# Altium schematic sheet Sheet1.SchDoc
size A
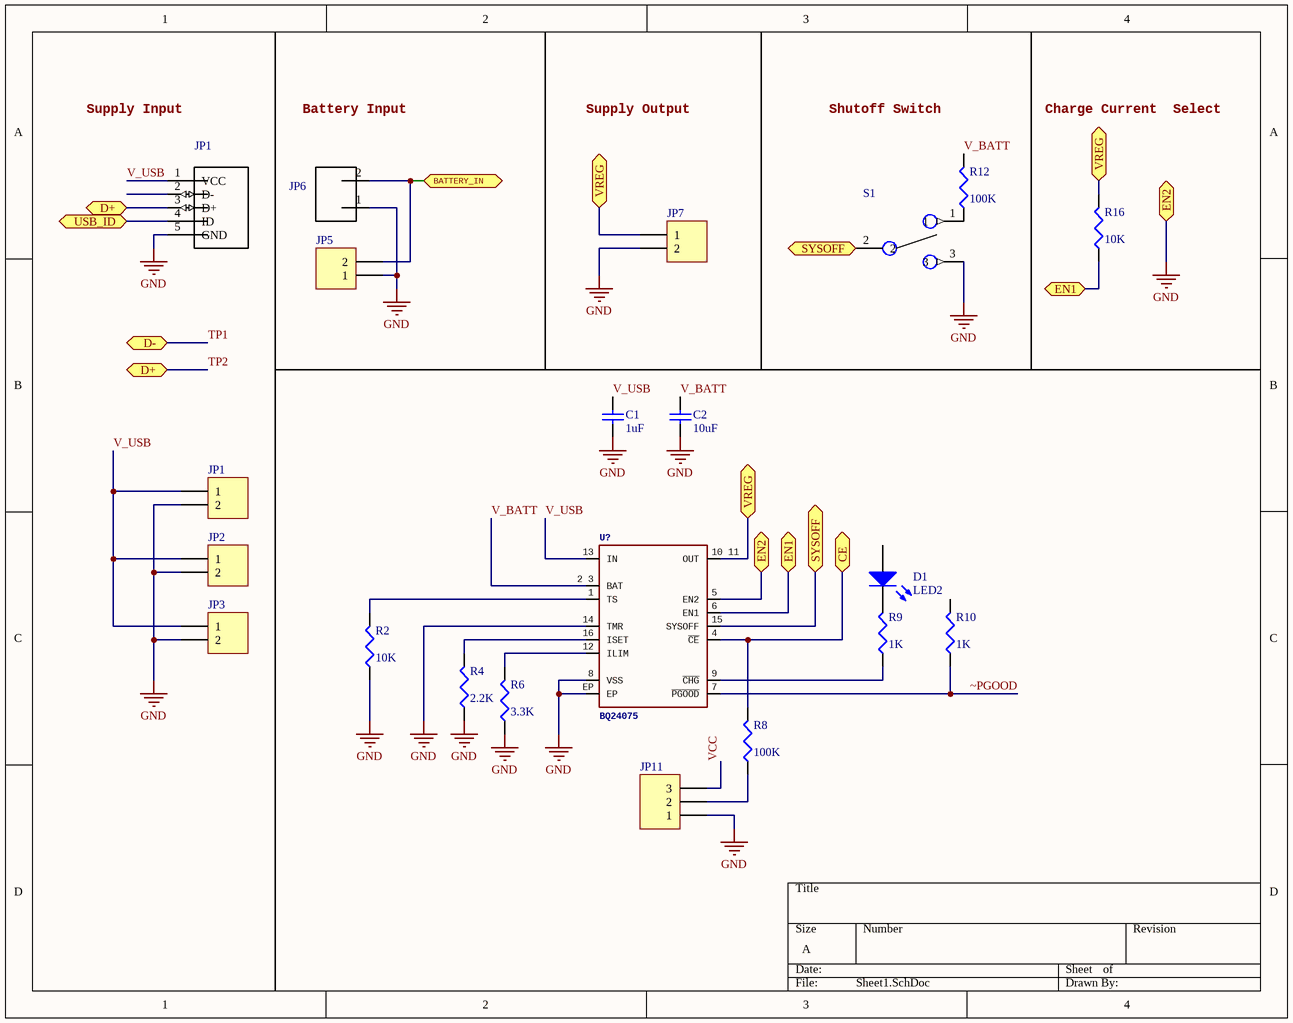
[diagram p0: Sheet1.SchDoc]

## Parts
(Parts that share a designator on the sheet are numbered #1, #2 ... from top to bottom, then left to right.)
C1  value 1uF  [1608[0603]]  (hidden comment: Cap Semi)
C2  value 10uF  [1608[0603]]  (hidden comment: Cap Semi)
D1  LED2  [3.2X1.6X1.1]
JP1#1  0475901001  [MOLEX_0475901001]  (value not drawn)
JP1#2  Header 2  [HDR1X2]  (value not drawn)
JP2  Header 2  [HDR1X2]  (value not drawn)
JP3  Header 2  [HDR1X2]  (value not drawn)
JP5  Header 2  [HDR1X2]  (value not drawn)
JP6  S2B-PH-SM4-TB(LF)(SN)  [S2B-PH-SM4-TB(LF)(SN)]  (value not drawn)
JP7  Header 2  [HDR1X2]  (value not drawn)
JP11  Header 3  [HDR1X3]  (value not drawn)
R2  value 10K  [1608[0603]]  (hidden comment: Res3)
R4  value 2.2K  [1608[0603]]  (hidden comment: Res3)
R6  value 3.3K  [1608[0603]]  (hidden comment: Res3)
R8  value 100K  [1608[0603]]  (hidden comment: Res3)
R9  value 1K  [1608[0603]]  (hidden comment: Res3)
R10  value 1K  [1608[0603]]  (hidden comment: Res3)
R12  value 100K  [1608[0603]]  (hidden comment: Res3)
R16  value 10K  [1608[0603]]  (hidden comment: Res3)
S1  AYZ0102AGRLC  [SW_AYZ0102AGRLC]  (value not drawn)
U?  BQ24075  [QFN50P300X300X100-17N]

## Ports
BATTERY_IN, CE, D+, D-, EN1, EN2, SYSOFF, USB_ID, VREG

## Nets
GND: C1.1 C2.1 JP1#1.5(GND) JP1#2.2 JP2.2 JP3.2 JP5.1 JP6.1 JP7.2 JP11.1 R2.1 R4.1 R6.1 S1.3 U?.5(EN2) U?.8(VSS) U?.14(TMR) U?.EP ; port EN2
BATTERY_IN: JP5.2 JP6.2 ; port BATTERY_IN
CE: R8.2 U?.4(~{CE}) ; port CE
EN1: R16.1 U?.6(EN1) ; port EN1
SYSOFF: S1.2 U?.15(SYSOFF) ; port SYSOFF
TP1: port D-
TP2: JP1#1.3(D+) ; port D+
USB_ID: JP1#1.4(ID) ; port USB_ID
V_BATT: C2.2 R12.2 U?.2_3(BAT)
V_USB: C1.2 JP1#1.1(VCC) JP1#2.1 JP2.1 JP3.1 U?.13(IN)
VCC: JP11.3
VREG: JP7.1 R16.2 U?.10_11(OUT) ; port VREG
~PGOOD: R10.1 U?.7(~{PGOOD})
NetJP11_2: JP11.2 R8.1
NetR2_2: R2.2 U?.1(TS)
NetR4_2: R4.2 U?.16(ISET)
NetR6_2: R6.2 U?.12(ILIM)
NetR9_1: R9.1 U?.9(~{CHG})
NetR12_1: R12.1 S1.1

Not connected (* = marked no-connect by the designer): D1 1(A) 2(K); JP1#1 2(D-); R9 2; R10 2

## Notes on the sheet
- Supply Input
- Battery Input
- Supply Output
- Shutoff Switch
- Charge Current
  Select

## Library data of the parts
C1 = Cap Semi: CAP CER 0.1UF 25V X7R 0603; Manufacturer: Murata Electronics North America; Manufacturer Part Number: GCM188R71E104KA57D; Digi-Key Part Number: 490-6051-1-ND; ComponentLink1URL: https://www.digikey.com/product-detail/en/murata-electronics-north-america/GCM188R71E104KA57D/490-6051-1-ND/3845251; ComponentLink1Description: Digi-Key Link
C2 = Cap Semi: CAP CER 10UF 25V X5R 1206; Manufacturer: Murata Electronics North America; Manufacturer Part Number: GJ831CR61E106KE83L; Digi-Key Part Number: 490-14441-1-ND; ComponentLink1URL: https://www.digikey.com/product-detail/en/murata-electronics-north-america/GJ831CR61E106KE83L/490-14441-1-ND/6606902; ComponentLink1Description: Digi-Key Link
D1 = LED2: Typical RED, GREEN, YELLOW, AMBER GaAs LED; Published: 8-Jun-2000; LatestRevisionDate: 17-Jul-2002; LatestRevisionNote: Re-released for DXP Platform.; PackageVersion: Feb-2002; PackageReference: 3.2X1.6X1.1; Publisher: Altium Limited; PackageDescription: SM LED; 2 Flat Leads
JP1#1 = 0475901001: Conn Micro USB Type AB RCP 5 POS 0.65mm Solder RA SMD 5 Terminal 1 Port Embossed T/R; Manufacturer: Molex, LLC; Digi-Key Part Number: WM14336CT-ND; Manufacturer Part Number: 0475901001; ComponentLink1URL: https://www.digikey.com/products/en/connectors-interconnects/usb-dvi-hdmi-connectors/312?k=0475901001&k=&pkeyword=0475901001&pv7=2&sf=0&quantity=&ColumnSort=0&page=1&pageSize=25; ComponentLink1Description: Digi-Key Link
JP1#2 JP2 JP3 JP5 JP7 = Header 2: Header, 2-Pin
JP6 = S2B-PH-SM4-TB(LF)(SN): CONN HEADER PH SIDE 2POS 2MM SMD; Manufacturer: JST Sales America Inc.; Digi-Key Part Number: 455-1749-1-ND; Manufacturer Part Number: S2B-PH-SM4-TB(LF)(SN); ComponentLink1URL: https://www.digikey.com/products/en/connectors-interconnects/rectangular-connectors-headers-male-pins/314?k=S2B-PH-SM4-TB%28LF%29%28SN%29&k=&pkeyword=S2B-PH-SM4-TB%28LF%29%28SN%29&pv7=2&sf=0&quantity=&ColumnSort=0&page=1&pageSize=25; ComponentLink1Description: Digi-Key URL
JP11 = Header 3: Header, 3-Pin; LatestRevisionDate: 17-Jul-2002; LatestRevisionNote: Re-released for DXP Platform.; Publisher: Altium Limited
R2 R16 = Res3: RES SMD 10K OHM 1% 1/8W 0603; Manufacturer: Vishay Beyschlag; Manufacturer Part Number: MCT06030C1002FP500; Digi-Key Part Number: MCT0603-10.0K-CFCT-ND; ComponentLink1URL: https://www.digikey.com/products/en?keywords=MCT0603-10.0K-CFCT-ND; ComponentLink1Description: Digi-Key URL
R4 = Res3: RES SMD 2.2K OHM 1% 1/10W 0603; Manufacturer: Panasonic Electronic Components; Manufacturer Part Number: ERJ-3EKF2201V; Digi-Key Part Number: P2.20KHCT-ND; ComponentLink1URL: https://www.digikey.com/product-detail/en/panasonic-electronic-components/ERJ-3EKF2201V/P2.20KHCT-ND/1746742; ComponentLink1Description: Digi-Key URL
R6 R8 R12 = Res3: RES SMD 3.3K OHM 5% 1/10W 0603; Manufacturer: Panasonic Electronic Components; Manufacturer Part Number: ERJ-3GEYJ332V; Digi-Key Part Number: P3.3KGCT-ND; ComponentLink1URL: https://www.digikey.com/product-detail/en/panasonic-electronic-components/ERJ-3GEYJ332V/P3.3KGCT-ND/135146; ComponentLink1Description: Digi-Key URL
R9 R10 = Res3: RES SMD 1K OHM 1% 1/8W 0603; Manufacturer: Vishay Beyschlag; Published: 8-Jun-2000; LatestRevisionDate: 29-May-2009; LatestRevisionNote: IPC-7351 Footprint Added.; PackageReference: J1-0603; Publisher: Altium Limited; PackageDescription: Chip Resistor; Digi-Key Part Number: Digi-Key Part Number; Component1LinkURL: http://www.vishay.com/docs/28705/mcx0x0xpro.pdf; ComponentLink1Description: Digi-Key URL
S1 = AYZ0102AGRLC: SWITCH SLIDE SPDT 100MA 12V; Manufacturer: C&K; Digi-Key Part Number: 401-2012-1-ND; Manufacturer Part Number: AYZ0102AGRLC; ComponentLink1URL: https://www.digikey.com/products/en/switches/slide-switches/213?k=AYZ0102AGRLC&k=&pkeyword=AYZ0102AGRLC&pv7=2&sf=0&quantity=&ColumnSort=0&page=1&pageSize=25; ComponentLink1Description: Digi-Key Link
U? = BQ24075: IC LI-ION CHARGE MGMT 16-QFN; Manufacturer: Texas Instruments; Digi-Key Part Number: BQ24075RGTR; Manufacturer Part Number: *; ComponentLink1URL: http://www.ti.com/lit/ds/symlink/bq24075.pdf; ComponentLink1Description: Digi-Key Link